# Altium schematic sheet PIC.SchDoc
size A4
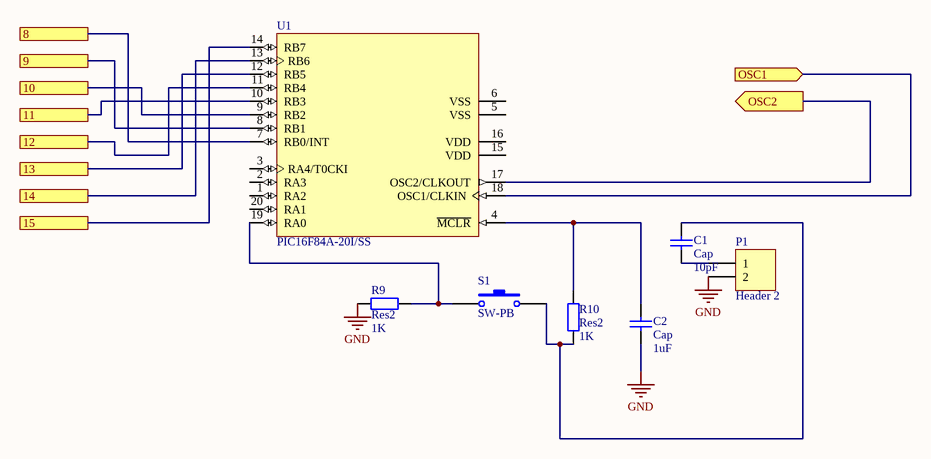
[diagram p0: PIC.SchDoc]

## Parts
C1  Cap  value 10pF  [RAD-0.3]
C2  Cap  value 1uF  [RAD-0.3]
P1  Header 2  [HDR1X2]
R9  Res2  value 1K  [AXIAL-0.4]
R10  Res2  value 1K  [AXIAL-0.4]
S1  SW-PB  [SPST-2]
U1  PIC16F84A-20I/SS  [SSOP-SS20_N]

## Ports
8, 9, 10, 11, 12, 13, 14, 15, OSC1 (in), OSC2 (out)

## Nets
GND: C2.1 P1.2 R9.1
8: U1.7(RB0/INT) ; port 8
9: U1.8(RB1) ; port 9
10: U1.9(RB2) ; port 10
11: U1.10(RB3) ; port 11
12: U1.11(RB4) ; port 12
13: U1.12(RB5) ; port 13
14: U1.13(RB6) ; port 14
15: U1.14(RB7) ; port 15
OSC1: U1.18(OSC1/CLKIN) ; port OSC1
OSC2: U1.17(OSC2/CLKOUT) ; port OSC2
NetC1_1: C1.1 P1.1
NetC1_2: C1.2 R10.1 S1.2
NetC2_2: C2.2 R10.2 U1.4(~{MCLR})
NetR9_2: R9.2 S1.1 U1.19(RA0)

Not connected (* = marked no-connect by the designer): U1 1(RA2) 2(RA3) 3(RA4/T0CKI) 5(VSS) 6(VSS) 15(VDD) 16(VDD) 20(RA1)

## Library data of the parts
C1 C2 = Cap: Capacitor; Published: 8-Jun-2000; LatestRevisionDate: 17-Jul-2002; LatestRevisionNote: Re-released for DXP Platform.; PackageReference: RAD-0.3; Publisher: Altium Limited; PackageDescription: Radial Cap, Thru-Hole; 2 Leads; 0.3 in Pin Spacing
P1 = Header 2: Header, 2-Pin; LatestRevisionDate: 17-Jul-2002; LatestRevisionNote: Re-released for DXP Platform.; Publisher: Altium Limited
R9 R10 = Res2: Resistor; Published: 8-Jun-2000; LatestRevisionDate: 17-Jul-2002; LatestRevisionNote: Re-released for DXP Platform.; PackageReference: AXIAL-0.4; Publisher: Altium Limited; PackageDescription: Axial Device, Thru-Hole; 2 Leads; 0.4 in Pin Spacing
S1 = SW-PB: Switch; Published: 24-Mar-1999; LatestRevisionDate: 17-Jul-2002; LatestRevisionNote: Re-released for DXP Platform.; PackageReference: SPST-2; Publisher: Altium Limited; PackageDescription: Switch; 2 Leads
U1 = PIC16F84A-20I/SS: Enhanced FLASH/EEPROM 8-Bit Microcontroller, 1K (x14-Bit words) FLASH, 68 Bytes RAM, 20 MHz, 20-Pin SSOP, Standard VDD Range, Industrial Temperature; Published: 11-Oct-2004; LatestRevisionDate: 29-Jan-2009; LatestRevisionNote: Sch. layout revised. 3D Model Removed.; DatasheetVersion: revB, Aug-2001; PackageVersion: revBB, Aug-2009; PackageReference: SSOP-SS20; Publisher: Altium Limited; PackageDescription: 20-Lead Plastic Shrink Small Outline (SS) - 5.3mm Body [SSOP]; Supplier 1: Digi-Key; Supplier Part Number 1: PIC16F84A-20I/SS-ND; Supplier 2: Farnell; Supplier Part Number 2: 1084268; Code_JEDEC: MO-150; Code_IPC: SOP65P780-20; ComponentLink1Description: Datasheet; ComponentLink1URL: http://ww1.microchip.com/downloads/en/DeviceDoc/35007b.pdf; ComponentLink2Description: Packaging Specification; ComponentLink2URL: http://www.microchip.com/stellent/groups/techpub_sg/documents/packagingspec/en012702.pdf; ComponentLink3Description: Microchip.com Home; ComponentLink3URL: http://www.microchip.com/